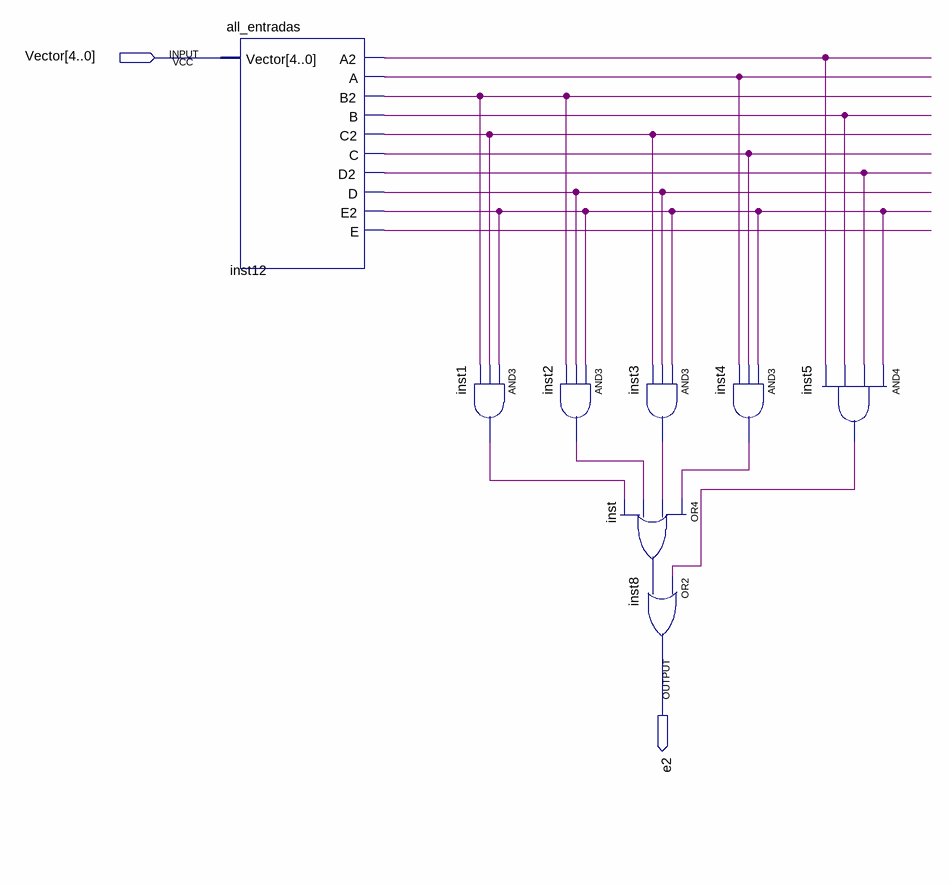
[diagram p0: schematic sheet]
// Quartus schematic e2.bdf as structural Verilog: 8 symbols, 2 pins
module e2 (
  input  [4:0] Vector,
  output e2
);

  wire inst1_out, inst2_out, inst3_out, inst4_out, inst5_out, inst12_a, inst12_a2, inst12_b, inst12_b2,
       inst12_c, inst12_c2, inst12_d, inst12_d2, inst12_e, inst12_e2, inst_out;

  all_entradas inst12 (
    .Vector(Vector), .A2(inst12_a2), .A(inst12_a), .B2(inst12_b2), .B(inst12_b), .C2(inst12_c2),
    .C(inst12_c), .D2(inst12_d2), .D(inst12_d), .E2(inst12_e2), .E(inst12_e));
  and inst1 (inst1_out, inst12_e2, inst12_c2, inst12_b2);
  and inst2 (inst2_out, inst12_e2, inst12_d, inst12_b2);
  or inst (inst_out, inst4_out, inst3_out, inst2_out, inst1_out);
  and inst3 (inst3_out, inst12_e2, inst12_d, inst12_c2);
  or inst8 (e2, inst5_out, inst_out);
  and inst4 (inst4_out, inst12_e2, inst12_c, inst12_a);
  and inst5 (inst5_out, inst12_e2, inst12_d2, inst12_b, inst12_a2);
endmodule
